# Altium schematic sheet mainboard.SCHDOC
size A3
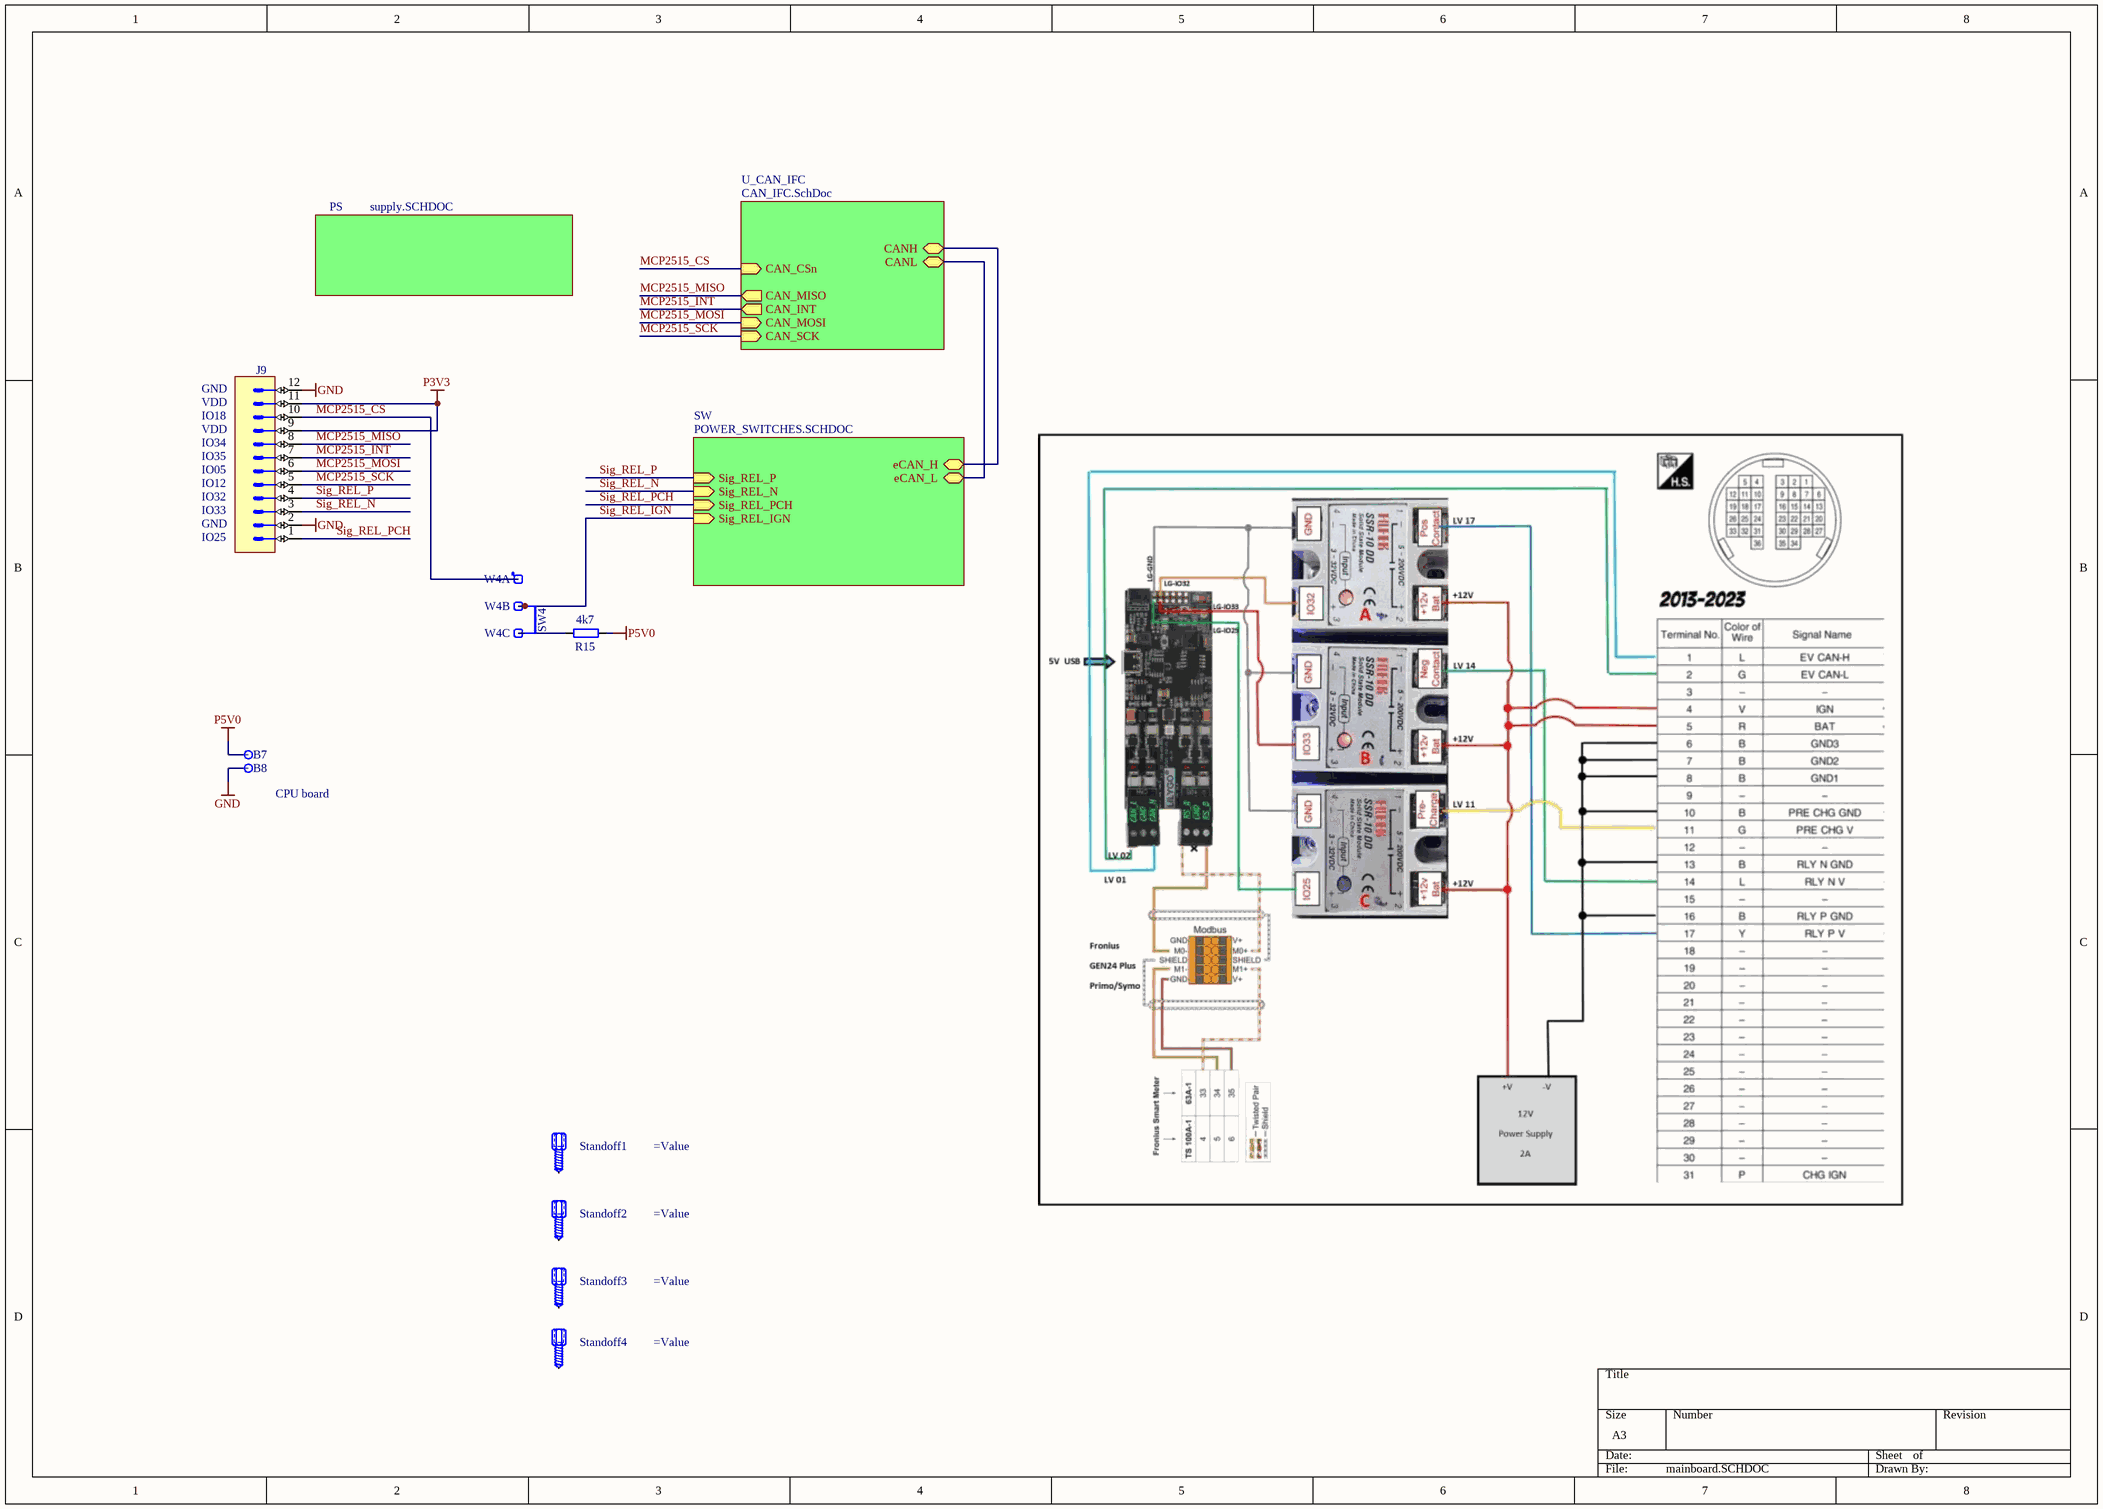
[diagram p0: mainboard.SCHDOC]

## Parts
B7  Plated Hole  [c150h80]  (value not drawn)  (no BOM)
B8  Plated Hole  [c150h80]  (value not drawn)  (no BOM)
J9  Header 12  [SAMTEC_TSW-106-23-L-D]  (value not drawn)
R15  4k7  [RESC1608X55N]
Standoff1  (no value)  [ETTINGER_005.13.113]
Standoff2  (no value)  [ETTINGER_005.13.113]
Standoff3  (no value)  [ETTINGER_005.13.113]
Standoff4  (no value)  [ETTINGER_005.13.113]
SW4  Jumper Type1  [JUMPER_BLACK_INSULATED_2.54MM]  (value not drawn)
W4  Test Point  [COMATEL_385.0358.1.03.400]  (value not drawn)  (parts A,B,C of 3)

## Sub-sheets
PS = supply.SCHDOC: no entries
SW = POWER_SWITCHES.SCHDOC: Sig_REL_P (in), Sig_REL_N (in), Sig_REL_PCH (in), Sig_REL_IGN (in), eCAN_H (bidir), eCAN_L (bidir)
U_CAN_IFC = CAN_IFC.SchDoc: CANH (bidir), CANL (bidir), CAN_CSn (in), CAN_MISO (out), CAN_SCK (in), CAN_INT (out), CAN_MOSI (in)

## Nets
GND: B8.1 J9.2 J9.12
P3V3: J9.9 J9.11
P5V0: B7.1 R15.2
MCP2515_CS: J9.10 W4.1 ; sheet U_CAN_IFC/CAN_CSn
MCP2515_INT: J9.7 ; sheet U_CAN_IFC/CAN_INT
MCP2515_MISO: J9.8 ; sheet U_CAN_IFC/CAN_MISO
MCP2515_MOSI : J9.6 ; sheet U_CAN_IFC/CAN_MOSI
MCP2515_SCK: J9.5 ; sheet U_CAN_IFC/CAN_SCK
Sig_REL_IGN: SW4.1 W4.2 ; sheet SW/Sig_REL_IGN
Sig_REL_N: J9.3 ; sheet SW/Sig_REL_N
Sig_REL_P: J9.4 ; sheet SW/Sig_REL_P
Sig_REL_PCH: J9.1 ; sheet SW/Sig_REL_PCH
NetR15_1: R15.1 W4.3
(unnamed): sheet SW/eCAN_H, sheet U_CAN_IFC/CANH
(unnamed): sheet SW/eCAN_L, sheet U_CAN_IFC/CANL

Not connected (* = marked no-connect by the designer): Standoff1 1; Standoff2 1; Standoff3 1; Standoff4 1

## Notes on the sheet
- (near J9) IO34
- VDD
- (near J9) IO18
- GND
- (near J9) IO32
- (near J9) IO33
- (near J9) IO12
- (near J9) IO05
- (near J9) IO35
- (near J9) IO25
- CPU board

## Library data of the parts
B7 B8 = PLATED_HOLE0.8_PAD1.5: Single Terminal Socket; Part Description: Plated Through Hole: Hole Dia.=0.8mm Pad Dia.=1.5mm, IPC-7251 Level A; Mounted: No; Part Number: PLATED_HOLE0.8_PAD1.5; Component Type: Standard (No BOM); Pin Count: 1; Family: Plated Hole; Socket: No; SMD: No; Sense: No; Status: None; ComponentHeight: 0mm; HelpURL: Undefined; Author: CERN DEM JLC; CreateDate: 11.05.2017; LatestRevisionDate: 11.05.2017; PackageDescription: Plated Through Hole: Hole Dia.=0.8mm Pad Dia.=1.3mm, IPC-7251 Level A
J9 = SAMTEC_TSW-106-23-L-D: Connector 12 Male; Part Description: 12 Contacts, Pitch 2.54mm, Dual Row Through Mount Straight Header (Post Lead 5.84mm, Tail Lead 2.92mm, Insulator 2.54mm); Manufacturer: SAMTEC; PressFit: No; Part Number: SAMTEC_TSW-106-23-L-D; Component Kind: Standard; Component Type: Standard; Pin Count: 12; Family: Header 12; Mounted: Yes; Socket: No; SMD: No; Sense: No; Status: None; Manufacturer Part Number: TSW-106-23-L-D; ComponentHeight: 8.38mm; HelpURL: \\cern.ch\dfs\Applications\Altium\Datasheets\SAMTEC_TSW-106-23-L-D.pdf; Author: CERN DEM MR; CreateDate: 08.03.2017; LatestRevisionDate: 08.03.2017
R15 = R0603_4K7_1%_0.1W_100PPM: Resistor - 1%; Part Description: General Purpose Thick Film Chip Resistor; Manufacturer: GENERIC; Manufacturer1 Part Number: NRC06F4701TRF; Power: 0.1W; TC: ±100ppm/°C; PressFit: No; Part Number: R0603_4K7_1%_0.1W_100PPM; Component Kind: Standard; Component Type: Standard; Pin Count: 2; Value: 4k7; Status: Preferred; Tolerance: ±1%; Manufacturer Part Number: R0603_4K7_1%_0.1W_100PPM; Case: 0603; Mounted: Yes; Sense: No; Socket: No; SMD: Yes; Manufacturer1 Example: NIC COMPONENT; Manufacturer1 ComponentHeight: 0.55mm; HelpURL: \\cern.ch\dfs\Applications\Altium\Datasheets\R0603_NIC_NRC.pdf; Author: CERN DEM JLC; CreateDate: 03.12.2007; LatestRevisionDate: 13.03.2008
Standoff1-Standoff4 = ETTINGER_005.13.113: Standoff Male-Female; Part Description: Standoff Nickel-Plated Brass M/F AF5.5x11 F=M3x7 M=M3x6; PressFit: No; Part Number: ETTINGER_005.13.113; Component Kind: Standard; Component Type: Mechanical; Pin Count: 1; PackageDescription: Standoff Nickel-Plated Brass M/F AF5.5x11 F=M3x7 M=M3x6; Mounted: Yes; Socket: No; SMD: No; Sense: No; Status: None; Manufacturer: ETTINGER; Manufacturer Part Number: 005.13.113; ComponentHeight: 11mm; HelpURL: \\cern.ch\dfs\Applications\Altium\Datasheets\ETTINGER_005.13.113.pdf; Author: CERN DEM HF; CreateDate: 17.05.2023; LatestRevisionDate: 17.05.2023
SW4 = COMATEL_313.1730.0.00.40.0: Jumper 1 Pin; Part Description: Closed Insulated Black Jumper Pitch 2.54mm; Manufacturer: KONTEK COMATEL; PressFit: No; SCEM: 09.55.10.960.9; Part Number: COMATEL_313.1730.0.00.40.0; Component Kind: Accessories; Component Type: Standard; Pin Count: 1; Family: Jumper; Mounted: Yes; Socket: No; SMD: No; Sense: No; Status: Obsolete; Manufacturer Part Number: 313.1730.0.00.40.0; ComponentHeight: 6.5mm; HelpURL: \\cern.ch\dfs\Applications\Altium\Datasheets\COMATEL_313.1730.0.00.40.0.pdf; Author: CERN DEM JLC; CreateDate: 09.04.2008; LatestRevisionDate: 27.08.2013
W4 = COMATEL_385.0358.1.03.400: 3 Mini Wire-Wrap Contact Strip Header; Part Description: 3 Contacts Straight Strip Header Pitch 2.54mm L=6.3mm ''Mini-Wire-Wrap''; Manufacturer: KONTEK COMATEL; PressFit: No; Part Number: COMATEL_385.0358.1.03.400; Component Kind: Standard; Component Type: Standard; Pin Count: 3; Family: Test Point; Mounted: Yes; Socket: No; SMD: No; Sense: No; Status: Not recommended; Manufacturer Part Number: 385.0358.1.03.400; ComponentHeight: 8mm; HelpURL: \\cern.ch\dfs\Applications\Altium\Datasheets\COMATEL_385.0358.1.03.400.pdf; Author: CERN DEM JLC; CreateDate: 30.06.2010; LatestRevisionDate: 10.10.2012